# Altium schematic sheet stated-rev1-env.SchDoc
size A4; SheetNumber: 3; SheetTotal: 4
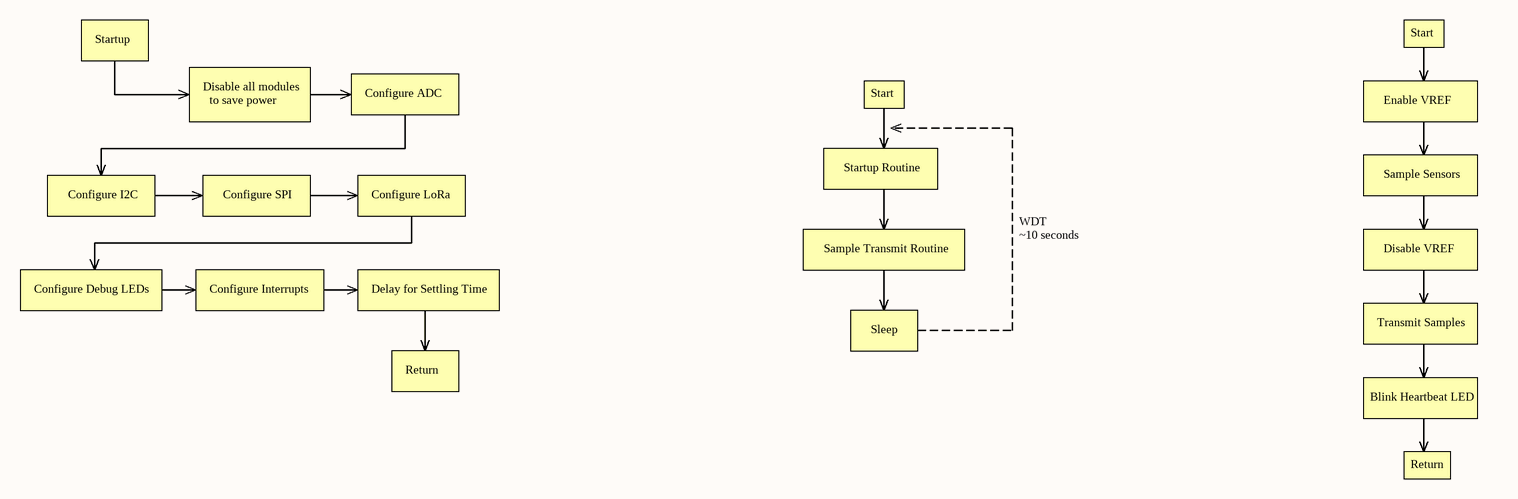
[diagram p0: stated-rev1-env.SchDoc]

## Notes on the sheet
- Startup
- Start
- Disable all modules
- to save power
- Configure ADC
- Enable VREF
- Configure I2C
- Configure SPI
- Configure LoRa
- Startup Routine
- Sample Sensors
- Sample Transmit Routine
- WDT
- ~10 seconds
- Disable VREF
- Configure Debug LEDs
- Configure Interrupts
- Delay for Settling Time
- Sleep
- Transmit Samples
- Return
- Blink Heartbeat LED